# Altium schematic sheet Epd_Header.SchDoc
size A3
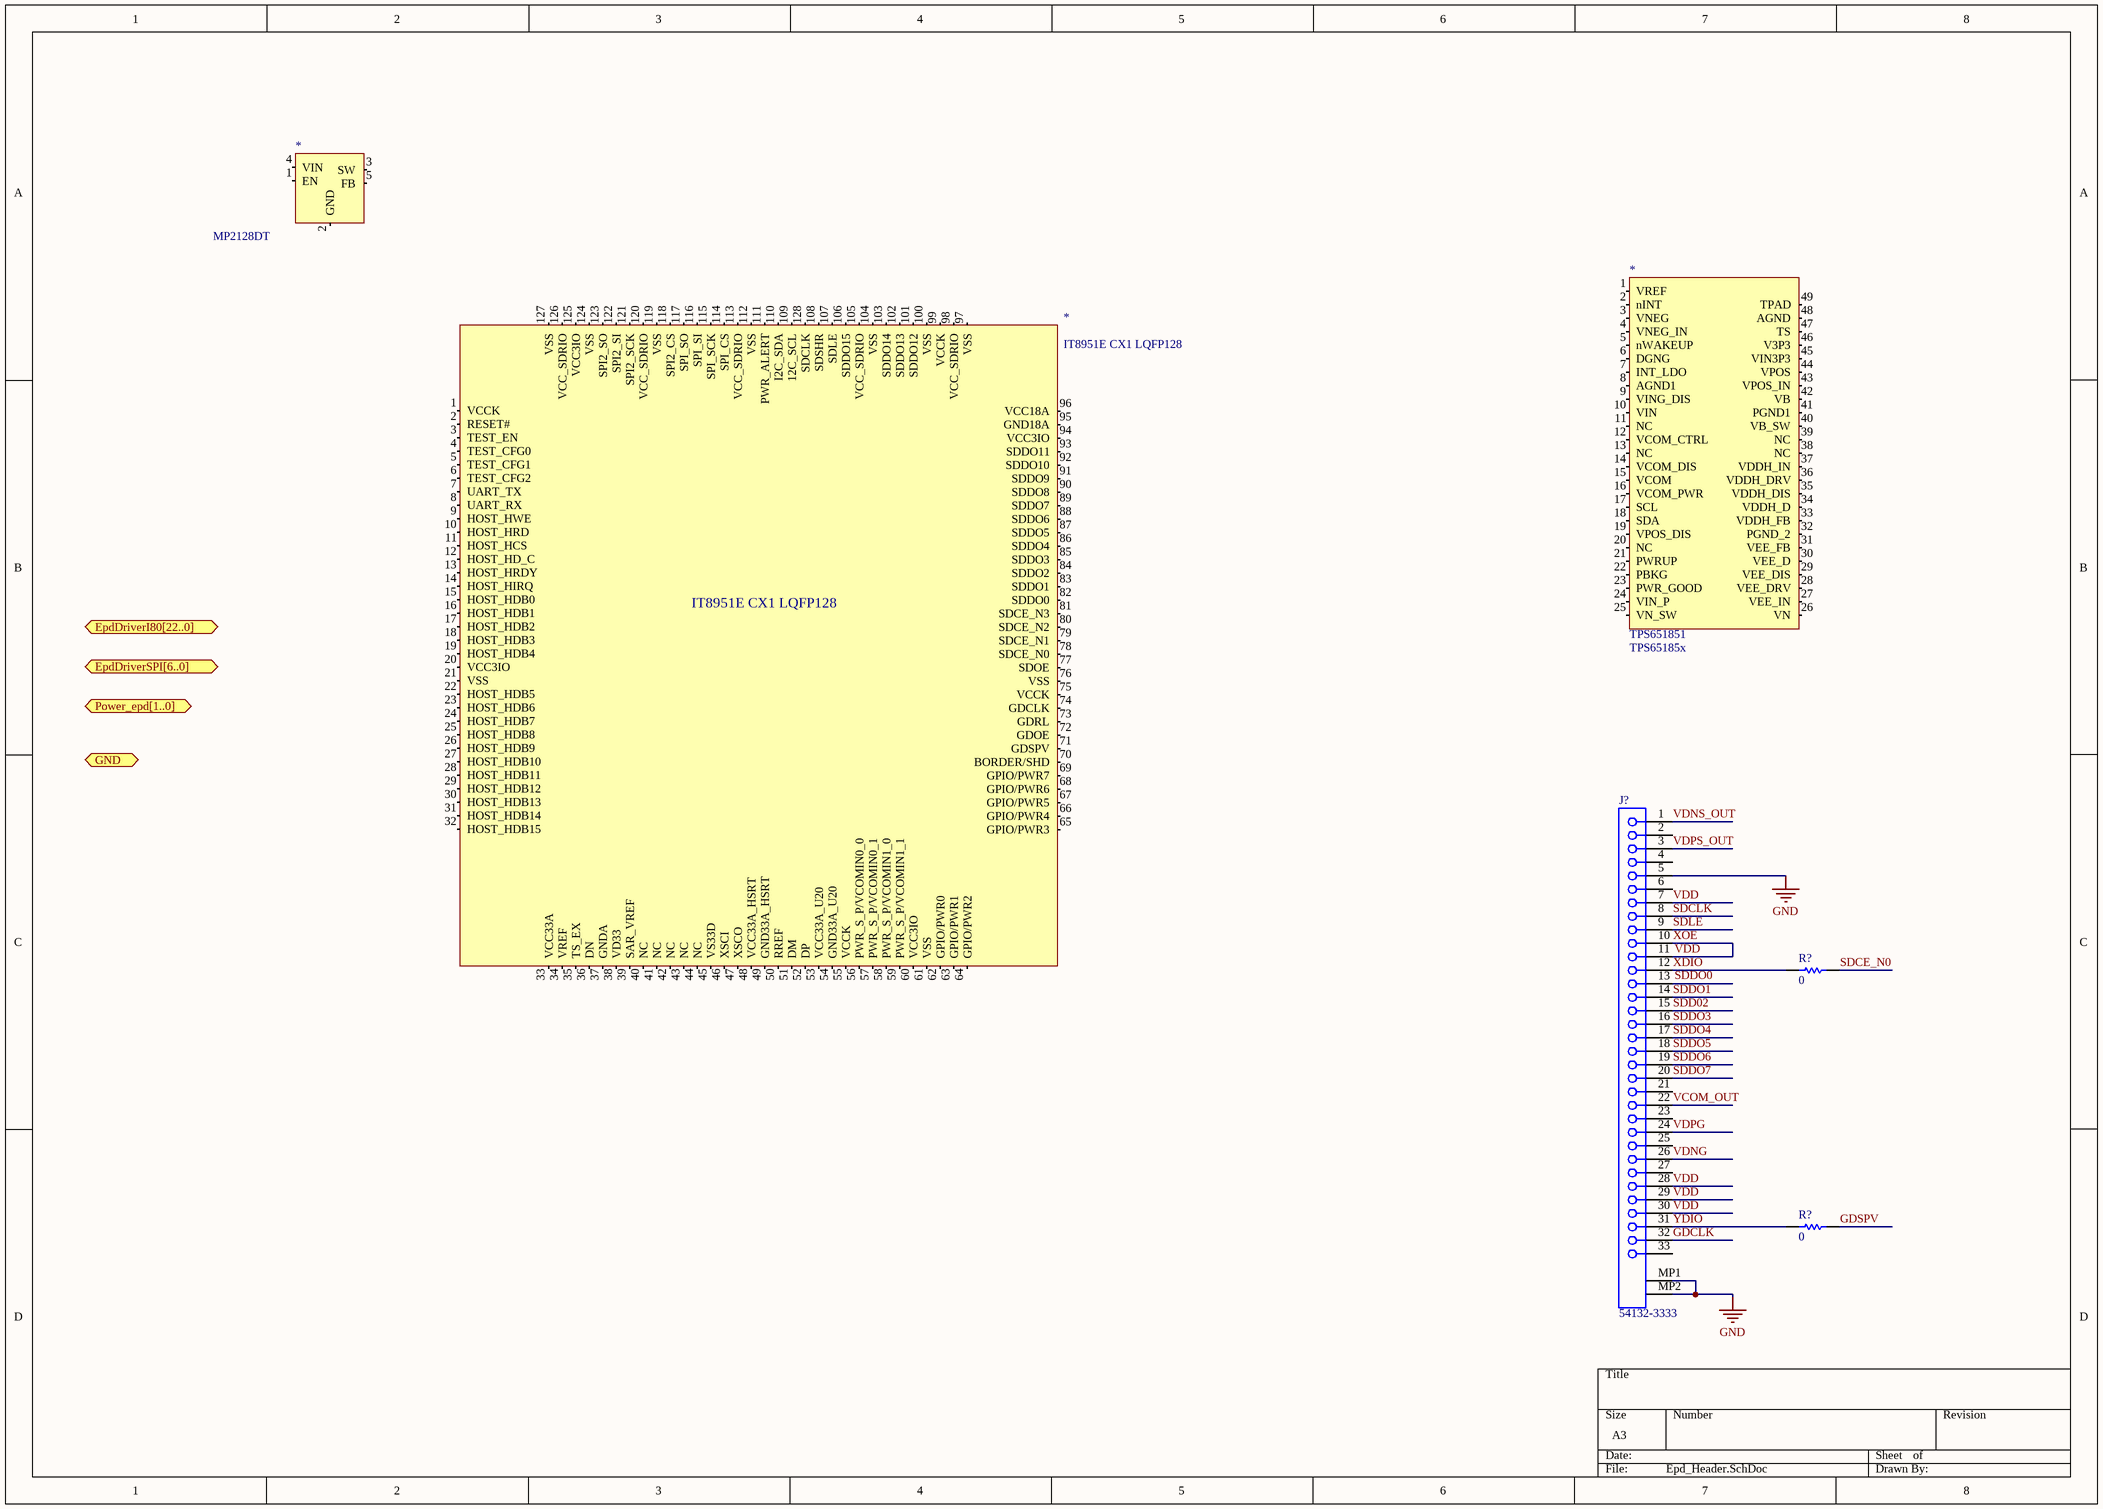
[diagram p0: Epd_Header.SchDoc]

## Parts
(Parts that share a designator on the sheet are numbered #1, #2 ... from top to bottom, then left to right.)
*#1  MP2128DT
*#2  TPS651851  Parameter 1: TPS65185x
*#3  ITEM: IT8951E CX1 LQFP128  (hidden comment: IT8951E DX LQFP128)
J?  54132-3333  [MOLX-54132-3333]
R?#1  0  [0603R]
R?#2  0  [0603R]

## Ports
EpdDriverI80[22..0] (bidir), EpdDriverSPI[6..0] (bidir), GND (bidir), Power_epd[1..0] (bidir)

## Nets
GND: J?.5 J?.MP1 J?.MP2
GDCLK: J?.32
GDSPV: R?#2.2
SDCE_N0: R?#1.2
SDCLK: J?.8
SDD02: J?.15
SDDO1: J?.14
SDDO3: J?.16
SDDO4: J?.17
SDDO5: J?.18
SDDO6: J?.19
SDDO7: J?.20
SDLE: J?.9
VCOM_OUT: J?.22
VDD: J?.7 J?.10 J?.11 J?.28 J?.29 J?.30  [also labelled XOE]
VDNG: J?.26
VDNS_OUT: J?.1
VDPG: J?.24
VDPS_OUT: J?.3
XDIO: J?.12 R?#1.1
YDIO: J?.31 R?#2.1

Not connected (* = marked no-connect by the designer): *#1 1(EN) 2(GND) 3(SW) 4(VIN) 5(FB); *#2 1(VREF) 2(nINT) 3(VNEG) 4(VNEG_IN) 5(nWAKEUP) 6(DGNG) 7(INT_LDO) 8(AGND1) 9(VING_DIS) 10(VIN) 11(NC) 12(VCOM_CTRL) 13(NC) 14(VCOM_DIS) 15(VCOM) 16(VCOM_PWR) 17(SCL) 18(SDA) 19(VPOS_DIS) 20(NC) 21(PWRUP) 22(PBKG) 23(PWR_GOOD) 24(VIN_P) 25(VN_SW) 26(VN) 27(VEE_IN) 28(VEE_DRV) 29(VEE_DIS) 30(VEE_D) 31(VEE_FB) 32(PGND_2) 33(VDDH_FB) 34(VDDH_D) 35(VDDH_DIS) 36(VDDH_DRV) 37(VDDH_IN) 38(NC) 39(NC) 40(VB_SW) 41(PGND1) 42(VB) 43(VPOS_IN) 44(VPOS) 45(VIN3P3) 46(V3P3) 47(TS) 48(AGND) 49(TPAD); *#3 1(VCCK) 2(RESET#) 3(TEST_EN) 4(TEST_CFG0) 5(TEST_CFG1) 6(TEST_CFG2) 7(UART_TX) 8(UART_RX) 9(HOST_HWE) 10(HOST_HRD) 11(HOST_HCS) 12(HOST_HD_C) 13(HOST_HRDY) 14(HOST_HIRQ) 15(HOST_HDB0) 16(HOST_HDB1) 17(HOST_HDB2) 18(HOST_HDB3) 19(HOST_HDB4) 20(VCC3IO) 21(VSS) 22(HOST_HDB5) 23(HOST_HDB6) 24(HOST_HDB7) 25(HOST_HDB8) 26(HOST_HDB9) 27(HOST_HDB10) 28(HOST_HDB11) 29(HOST_HDB12) 30(HOST_HDB13) 31(HOST_HDB14) 32(HOST_HDB15) 33(VCC33A) 34(VREF) 35(TS_EX) 36(DN) 37(GNDA) 38(VD33) 39(SAR_VREF) 40(NC) 41(NC) 42(NC) 43(NC) 44(NC) 45(VS33D) 46(XSCI) 47(XSCO) 48(VCC33A_HSRT) 49(GND33A_HSRT) 50(RREF) 51(DM) 52(DP) 53(VCC33A_U20) 54(GND33A_U20) 55(VCCK) 56(PWR_S_P/VCOMIN0_0) 57(PWR_S_P/VCOMIN0_1) 58(PWR_S_P/VCOMIN1_0) 59(PWR_S_P/VCOMIN1_1) 60(VCC3IO) 61(VSS) 62(GPIO/PWR0) 63(GPIO/PWR1) 64(GPIO/PWR2) 65(GPIO/PWR3) 66(GPIO/PWR4) 67(GPIO/PWR5) 68(GPIO/PWR6) 69(GPIO/PWR7) 70(BORDER/SHD) 71(GDSPV) 72(GDOE) 73(GDRL) 74(GDCLK) 75(VCCK) 76(VSS) 77(SDOE) 78(SDCE_N0) 79(SDCE_N1) 80(SDCE_N2) 81(SDCE_N3) 82(SDDO0) 83(SDDO1) 84(SDDO2) 85(SDDO3) 86(SDDO4) 87(SDDO5) 88(SDDO6) 89(SDDO7) 90(SDDO8) 91(SDDO9) 92(SDDO10) 93(SDDO11) 94(VCC3IO) 95(GND18A) 96(VCC18A) 97(VSS) 98(VCC_SDRIO) 99(VCCK) 100(VSS) 101(SDDO12) 102(SDDO13) 103(SDDO14) 104(VSS) 105(VCC_SDRIO) 106(SDDO15) 107(SDLE) 108(SDSHR) 109(12C_SCL) 110(I2C_SDA) 111(PWR_ALERT) 112(VSS) 113(VCC_SDRIO) 114(SPI_CS) 115(SPI_SCK) 116(SPI_SI) 117(SPI_SO) 118(SPI2_CS) 119(VSS) 120(VCC_SDRIO) 121(SPI2_SCK) 122(SPI2_SI) 123(SPI2_SO) 124(VSS) 125(VCC3IO) 126(VCC_SDRIO) 127(VSS) 128(SDCLK); J? 2 4 6 13 21 23 25 27 33

## Notes on the sheet
- Labels drawn without touching a wire or pin: SDDO0

## Library data of the parts
*#1 = MP2128DT: MP2128DT Step down 2.5-6V to 1.8V 1A
*#2 = TPS651851: TPS651851 TPS65185x PMIC for E Ink® Vizplex™ Enabled Electronic Paper Display /
J? = CMP-1241-00520-1: 0.5 mm Pitch Easy-On(TM) Type FPC Connector, 2.0 mm Mated Height, Right Angle, ZIF, SMT, Bottom Contact, 33 Circuits, -40 to 85 degC, ELV and RoHS Compliant, Tape and Reel; Manufacturer: Molex; PCB Retention: None; Voltage (Max): 50V; Durability (mating cycles max): 20; Material - Metal: Phosphor Bronze; Entry Angle: 90degrees Angle; Pitch - Mating Interface: 0.50mm; Mated Height: 2.00mm; Material - Plating Mating: Silver, Tin-Bismuth; Circuits (Loaded): 33; Polarized to PCB: Yes; Current (Max per Contact): 0.5A; Stackable: No; ComponentLink1URL: http://www.molex.com/molex/index.jsp; Number of Rows: 1; PackageVersion: Rev. A, 08/2013; ComponentLink2Description: Datasheet; PackageReference: 54132-3333; ComponentLink3URL: http://www.molex.com/pdm_docs/sd/541323333_sd.pdf; ComponentLink2URL: http://www.molex.com/webdocs/datasheets/pdf/en-us/0541323333_FFC_FPC_CONNECTORS.pdf; Mounting Technology: Surface Mount; Contact Position: Bottom; PackageDescription: 33-Lead FPC Connector, Pitch 0.5 mm; Pitch - Termination Interface: 0.50mm; ComponentLink1Description: Manufacturer URL; PartNumber: 54132-3333; RoHS: TRUE; Material - Plating Termination: Silver, Tin-Bismuth; Packing: Tape and Reel; PCB Locator: No; ComponentLink3Description: Package Specification; Orientation: Right Angle
R?#1 R?#2 = Res1_1: Resistor; Value: 1K; Published: 8-Jun-2000; Revision: July-2002: Re-released for DXP Platform.; Publisher: Altium Limited